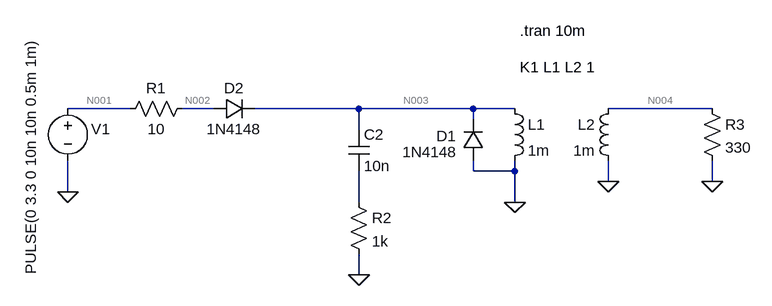
[diagram p0: schematic v1.0.asc]
v1.0.asc, the LTspice schematic file:
Version 4.1
SHEET 1 880 680
WIRE -96 96 -192 96
WIRE 32 96 -16 96
WIRE 256 96 96 96
WIRE 432 96 256 96
WIRE 496 96 432 96
WIRE 800 96 640 96
WIRE 432 112 432 96
WIRE 256 128 256 96
WIRE 432 192 432 176
WIRE 496 192 496 176
WIRE 496 192 432 192
WIRE 640 208 640 176
WIRE 800 208 800 176
WIRE -192 224 -192 176
WIRE 256 240 256 192
WIRE 496 240 496 192
WIRE 256 352 256 320
FLAG 496 240 0
FLAG 640 208 0
FLAG -192 224 0
FLAG 256 352 0
FLAG 800 208 0
SYMBOL ind 480 80 R0
SYMATTR InstName L1
SYMATTR Value 1m
SYMATTR Type ind
SYMATTR SpiceLine Rser=6.3
SYMBOL ind 656 80 M0
SYMATTR InstName L2
SYMATTR Value 1m
SYMATTR Type ind
SYMATTR SpiceLine Rser=6.3
SYMBOL voltage -192 80 R0
WINDOW 0 36 47 Left 2
WINDOW 3 -57 -93 VRight 2
WINDOW 123 0 0 Left 0
WINDOW 39 0 0 Left 0
SYMATTR InstName V1
SYMATTR Value PULSE(0 3.3 0 10n 10n 0.5m 1m)
SYMBOL diode 448 176 R180
WINDOW 0 42 38 Left 2
WINDOW 3 40 13 Left 2
SYMATTR InstName D1
SYMATTR Value 1N4148
SYMBOL res 0 80 R90
WINDOW 0 0 56 VBottom 2
WINDOW 3 32 56 VTop 2
SYMATTR InstName R1
SYMATTR Value 10
SYMBOL cap 240 128 R0
SYMATTR InstName C2
SYMATTR Value 10n
SYMBOL res 240 224 R0
SYMATTR InstName R2
SYMATTR Value 1k
SYMBOL res 784 80 R0
SYMATTR InstName R3
SYMATTR Value 330
SYMBOL diode 32 112 R270
WINDOW 0 32 32 VTop 2
WINDOW 3 0 32 VBottom 2
SYMATTR InstName D2
SYMATTR Value 1N4148
TEXT 504 32 Left 2 !K1 L1 L2 1
TEXT 504 -24 Left 2 !.tran 10m

The netlist it stands for:
* v1.0.asc
L1 N003 0 1m Rser=6.3
L2 N004 0 1m Rser=6.3
V1 N001 0 PULSE(0 3.3 0 10n 10n 0.5m 1m)
D1 0 N003 1N4148
R1 N002 N001 10
C2 N003 N005 10n
R2 N005 0 1k
R3 N004 0 330
D2 N002 N003 1N4148
.model D D
.lib standard.dio
K1 L1 L2 1
.tran 10m
.backanno
.end

* Results of the author's LTspice run, read from the files saved beside the schematic
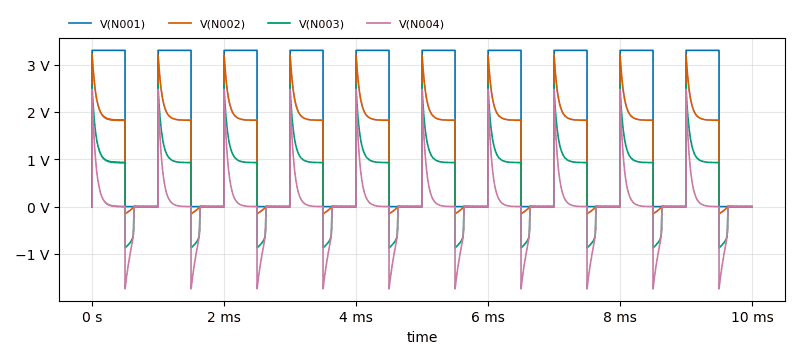
[diagram p1: Transient Analysis of v1.0.asc, plotted from the saved traces]
* Transient Analysis, 1 run:
*   V(N001): min 0 V, max 3.3 V, average 1.65 V, rms 2.333 V, last 0 V
*   V(N002): min -156 mV, max 3.207 V, average 985.9 mV, rms 1.426 V, last 12.21 µV
*   V(N003): min -873.7 mV, max 2.57 V, average 458.8 mV, rms 869.9 mV, last -588.9 µV
*   V(N004): min -1.736 V, max 2.476 V, average 0 V, rms 589.9 mV, last -567.2 µV